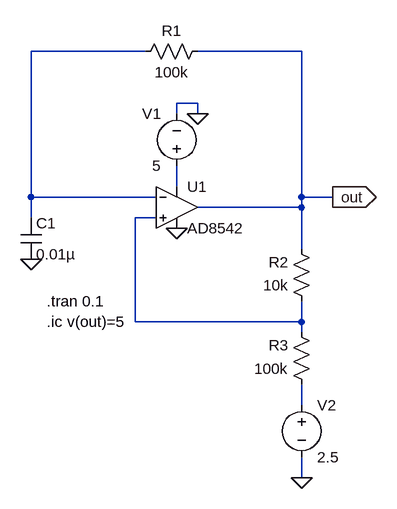
[diagram p0: schematic Draft17.asc]
Draft17.asc, the LTspice schematic file:
Version 4
SHEET 1 880 704
WIRE 336 32 160 32
WIRE 576 32 416 32
WIRE 416 112 384 112
WIRE 384 128 384 112
WIRE 416 128 416 112
WIRE 384 240 384 208
WIRE 160 256 160 32
WIRE 352 256 160 256
WIRE 576 256 576 32
WIRE 624 256 576 256
WIRE 576 272 576 256
WIRE 576 272 416 272
WIRE 160 288 160 256
WIRE 352 288 320 288
WIRE 576 336 576 272
WIRE 320 448 320 288
WIRE 576 448 576 416
WIRE 576 448 320 448
WIRE 576 464 576 448
WIRE 576 576 576 544
WIRE 576 688 576 656
FLAG 576 688 0
FLAG 416 128 0
FLAG 384 304 0
FLAG 160 352 0
FLAG 624 256 out
IOPIN 624 256 Out
SYMBOL Opamps/AD8542 384 208 R0
SYMATTR InstName U1
SYMBOL res 432 16 R90
WINDOW 0 0 56 VBottom 2
WINDOW 3 32 56 VTop 2
SYMATTR InstName R1
SYMATTR Value 100k
SYMBOL res 592 432 R180
WINDOW 0 36 76 Left 2
WINDOW 3 36 40 Left 2
SYMATTR InstName R2
SYMATTR Value 10k
SYMBOL res 592 560 R180
WINDOW 0 36 76 Left 2
WINDOW 3 36 40 Left 2
SYMATTR InstName R3
SYMATTR Value 100k
SYMBOL voltage 384 224 R180
WINDOW 0 24 96 Left 2
WINDOW 3 24 16 Left 2
SYMATTR InstName V1
SYMATTR Value 5
SYMBOL voltage 576 560 R0
SYMATTR InstName V2
SYMATTR Value 2.5
SYMBOL cap 144 288 R0
SYMATTR InstName C1
SYMATTR Value 0.01µ
TEXT 184 416 Left 2 !.tran 0.1
TEXT 184 448 Left 2 !.ic v(out)=5

The netlist it stands for:
* Draft17.asc
XU1 N003 N001 N002 0 out AD8542  ; pins In+ In- V+ V- OUT
R1 out N001 100k
R2 N003 out 10k
R3 N004 N003 100k
V1 N002 0 5
V2 N004 0 2.5
C1 N001 0 0.01µ
.tran 0.1
.ic v(out)=5
.lib AD8542.sub
.backanno
.end